# Altium schematic sheet 04_FEATHER-CONNECTION.SchDoc
size A4; CheckedBy: Inženjer 2; CompanyName: Byte Lab Grupa d.o.o.; Engineer: Matija Puskar; Organization: Byte Lab Grupa d.o.o.; Address1: Medarska 69/1, 10000 Zagreb, Croatia; DocumentNumber: 1; SheetNumber: 4; SheetTotal: 7; Web: www.byte-lab.com; ProjectName: P1X-0XX
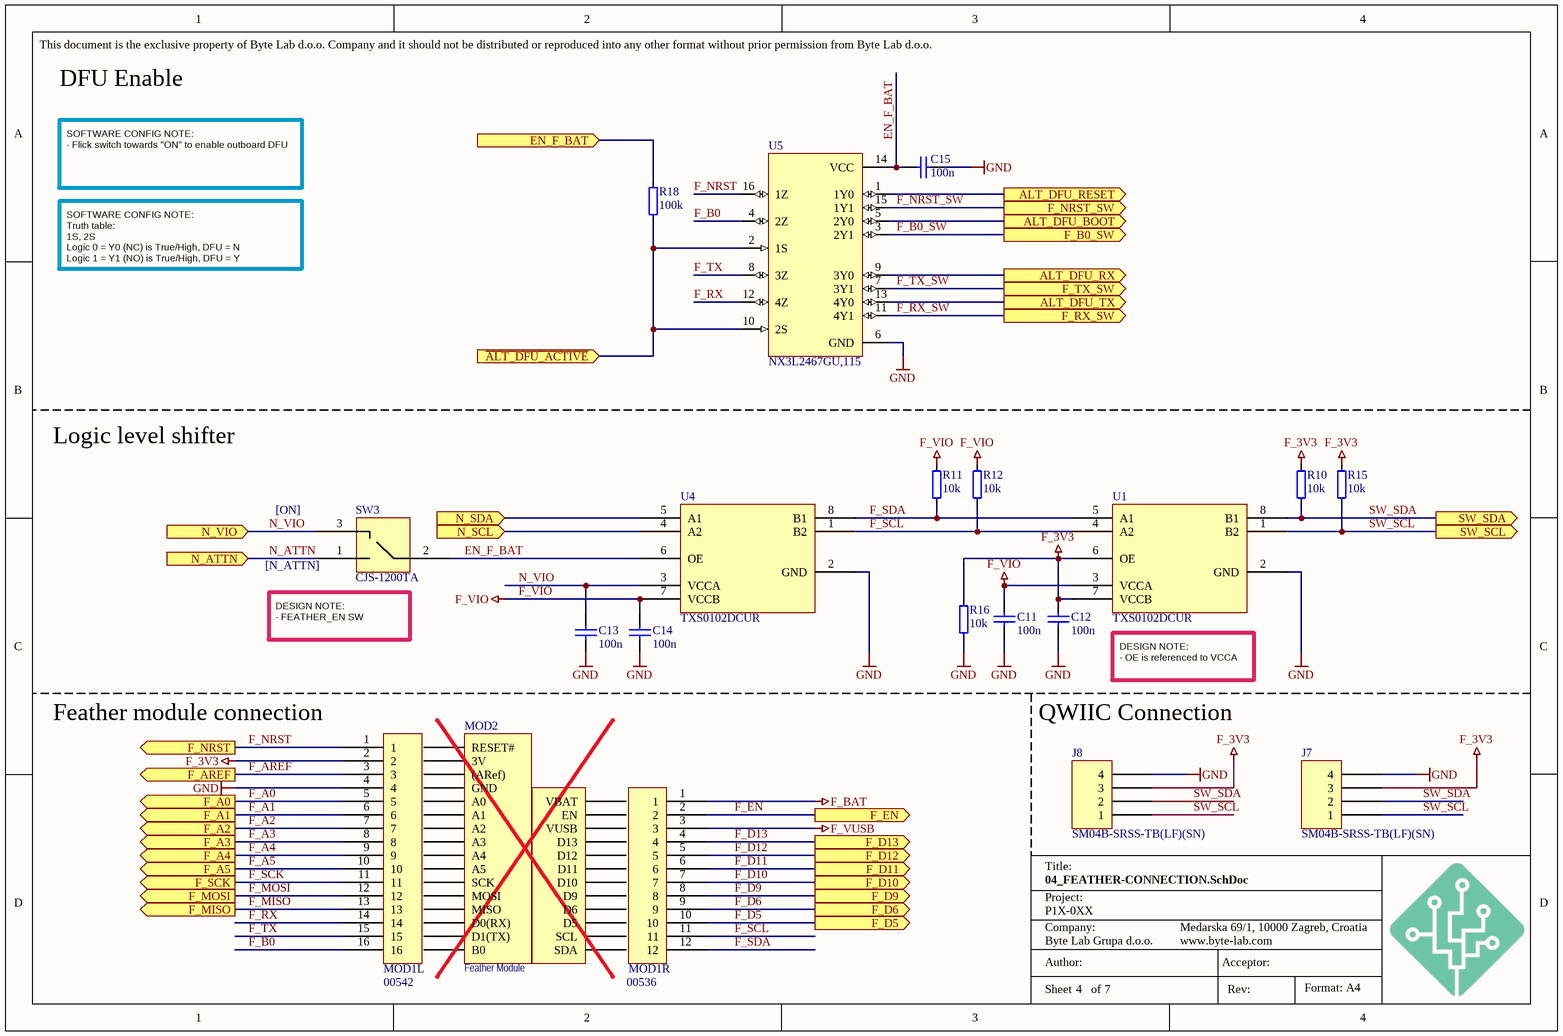
[diagram p0: 04_FEATHER-CONNECTION.SchDoc]

## Parts
C11  100n  [C-0402]
C12  100n  [C-0402]
C13  100n  [C-0402]
C14  100n  [C-0402]
C15  100n  [C-0402]
J7  SM04B-SRSS-TB(LF)(SN)  [JST SM04B-SRSS-TB]
J8  SM04B-SRSS-TB(LF)(SN)  [JST SM04B-SRSS-TB]
MOD1L  00542  [16PIN_254MM]
MOD1R  00536  [12PIN_254MM]
MOD2  Feather Module  [BLUES_WIRELESS_SWAN_2-54_HEADERS]  (no BOM)
R10  10k  [R-0402]
R11  10k  [R-0402]
R12  10k  [R-0402]
R15  10k  [R-0402]
R16  10k  [R-0402]
R18  100k  [R-0402]
SW3  CJS-1200TA  [SW_CJS-1200TA]
U1  TXS0102DCUR  [SOP50P310X90-8N]
U4  TXS0102DCUR  [SOP50P310X90-8N]
U5  NX3L2467GU,115  [QFN40P180X260X55-16N]

## Ports
ALT_DFU_BOOT (out), ALT_DFU_RESET (out), ALT_DFU_RX (out), ALT_DFU_TX (out), EN_F_BAT (in), F_A0 (out), F_A1 (out), F_A2 (out), F_A3 (out), F_A4 (out), F_A5 (out), F_AREF (out), F_B0_SW (out), F_D5 (out), F_D6 (out), F_D9 (out), F_D10 (out), F_D11 (out), F_D12 (out), F_D13 (out), F_EN (out), F_MISO (out), F_MOSI (out), F_NRST (out), F_NRST_SW (out), F_RX_SW (out), F_SCK (out), F_TX_SW (out), N_ATTN (in), N_SCL (in), N_SDA (in), N_VIO (in), SW_SCL (out), SW_SDA (out), ~{ALT_DFU_ACTIVE} (in)

## Nets
F_3V3: C12.1 J7.3 J8.3 MOD1L.2 R10.2 R15.2 R16.1 U1.6(OE) U1.7(VCCB)
F_BAT: MOD1R.1
F_VIO: C11.1 C14.1 R11.2 R12.2 U1.3(VCCA) U4.7(VCCB)
F_VUSB: MOD1R.3
GND: C11.2 C12.2 C13.2 C14.2 C15.1 J7.4 J8.4 MOD1L.4 R16.2 U1.2(GND) U4.2(GND) U5.6(GND)
~{ALT_DFU_ACTIVE}: R18.1 U5.2(1S) U5.10(2S) ; port ~{ALT_DFU_ACTIVE}
ALT_DFU_BOOT: U5.5(2Y0) ; port ALT_DFU_BOOT
ALT_DFU_RESET: U5.1(1Y0) ; port ALT_DFU_RESET
ALT_DFU_RX: U5.9(3Y0) ; port ALT_DFU_RX
ALT_DFU_TX: U5.13(4Y0) ; port ALT_DFU_TX
EN_F_BAT: C15.2 SW3.2 U4.6(OE) U5.14(VCC)
EN_F_BAT: R18.2 ; port EN_F_BAT  [a separate net that carries the same name]
F_A0: MOD1L.5 ; port F_A0
F_A1: MOD1L.6 ; port F_A1
F_A2: MOD1L.7 ; port F_A2
F_A3: MOD1L.8 ; port F_A3
F_A4: MOD1L.9 ; port F_A4
F_A5: MOD1L.10 ; port F_A5
F_AREF: MOD1L.3 ; port F_AREF
F_B0: MOD1L.16 U5.4(2Z)
F_B0_SW: U5.3(2Y1) ; port F_B0_SW
F_D5: MOD1R.10 ; port F_D5
F_D6: MOD1R.9 ; port F_D6
F_D9: MOD1R.8 ; port F_D9
F_D10: MOD1R.7 ; port F_D10
F_D11: MOD1R.6 ; port F_D11
F_D12: MOD1R.5 ; port F_D12
F_D13: MOD1R.4 ; port F_D13
F_EN: MOD1R.2 ; port F_EN
F_MISO: MOD1L.13 ; port F_MISO
F_MOSI: MOD1L.12 ; port F_MOSI
F_NRST: MOD1L.1 U5.16(1Z) ; port F_NRST
F_NRST_SW: U5.15(1Y1) ; port F_NRST_SW
F_RX: MOD1L.14 U5.12(4Z)
F_RX_SW: U5.11(4Y1) ; port F_RX_SW
F_SCK: MOD1L.11 ; port F_SCK
F_SCL: MOD1R.11 R12.1 U1.4(A2) U4.1(B2)
F_SDA: MOD1R.12 R11.1 U1.5(A1) U4.8(B1)
F_TX: MOD1L.15 U5.8(3Z)
F_TX_SW: U5.7(3Y1) ; port F_TX_SW
N_ATTN: SW3.1 ; port N_ATTN
N_SCL: U4.4(A2) ; port N_SCL
N_SDA: U4.5(A1) ; port N_SDA
N_VIO: C13.1 SW3.3 U4.3(VCCA) ; port N_VIO
SW_SCL: J7.1 J8.1 R15.1 U1.1(B2) ; port SW_SCL
SW_SDA: J7.2 J8.2 R10.1 U1.8(B1) ; port SW_SDA

Not connected (* = marked no-connect by the designer): MOD2 1(RESET#) 2(3V) 3((ARef)) 4(GND) 5(A0) 6(A1) 7(A2) 8(A3) 9(A4) 10(A5) 11(SCK) 12(MOSI) 13(MISO) 14(D0(RX)) 15(D1(TX)) 16(B0) 17(SDA) 18(SCL) 19(D5) 20(D6) 21(D9) 22(D10) 23(D11) 24(D12) 25(D13) 26(VUSB) 27(EN) 28(VBAT)

## Notes on the sheet
- DFU Enable
- SOFTWARE CONFIG NOTE:
  - Flick switch towards "ON" to enable outboard DFU
- SOFTWARE CONFIG NOTE:
  Truth table:
  1S, 2S
  Logic 0 = Y0 (NC) is True/High, DFU = N
  Logic 1 = Y1 (NO) is True/High, DFU = Y
- Logic level shifter
- [ON]
- (near SW3) [N_ATTN]
- (near SW3) DESIGN NOTE:
  - FEATHER_EN SW
- DESIGN NOTE:
  - OE is referenced to VCCA
- (near MOD1L) Feather module connection
- QWIIC Connection
- This document is the exclusive property of Byte Lab d.o.o. Company and it should not be distributed or reproduced into any other format without prior permission from Byte Lab d.o.o.
- Project:
- Title:
- Author:
- Company:
- Acceptor:
- Format: A4
- Sheet
- of
- Rev:

## Library data of the parts
C11-C15 = C0402-100n-16V-X7R: Capacitor ceramic 100n ±10% X7R 16V 0402; BL Part Number: 2000-908; Drawn_By: Puskar; Checked_By: Dodig; Manufacturer: N/A; Supplier 1: Digi-Key; Supplier Part Number 1: 490-3261-1-ND; Note: *; Manufacturer Part Number: N/A; DateModified: 27-08-2013
J7 J8 = SM04B-SRSS-TB(LF)(SN): CONN HEADER SH 4POS SIDE 1MM TIN; Manufacturer: JST Sales America Inc.; BL Part Number: 2002-058; Drawn_By: Blues Wireless; Supplier 1: Digi-Key; Manufacturer Part Number: SM04B-SRSS-TB(LF)(SN); Supplier Part Number 1: 455-1804-1-ND
MOD1L = SOCKET_LFB_16: Socket 16-Pin, 0.100 in; Manufacturer: 4UCON; BL Part Number: 2010-423; Drawn_By: Blues Wireless; Supplier 1: *; Supplier Part Number 1: *; Manufacturer Part Number: 00542
MOD1R = SOCKET_LFB_12: Socket 12-Pin, 0.100 in; Manufacturer: 4UCON; BL Part Number: 2010-424; Drawn_By: Blues Wireless; Supplier 1: *; Supplier Part Number 1: *; Manufacturer Part Number: 00536
MOD2 = ADAFRUIT_FEATHER_COMMON_1: Typical Adafruit Feather Pinout
R10-R12 R15 R16 = R0402-10k-1: Resistor 10k ±1% 0402; BL Part Number: 2000-729; Checked_By: Dodig; Drawn_By: Puskar; Supplier 1: Digi-Key; Manufacturer: N/A; Manufacturer Part Number: N/A; Supplier Part Number 1: 311-10.0KLRCT-ND; DateModified: 27-08-2013; Note: *
R18 = R0402-100k-1: Resistor 100k ±1% 0402; BL Part Number: 2000-727; Checked_By: Dodig; Drawn_By: Puskar; Supplier 1: Digi-Key; Manufacturer: N/A; Manufacturer Part Number: N/A; Supplier Part Number 1: RHM100CDCT-ND; DateModified: 27-10-2013; Note: *
SW3 = CJS-1200TA: Switch Slide N.O./N.C. SPDT Raised Slide 0.1A 24VDC J-Hook SMD Embossed T/R; Manufacturer: Nidec Copal; BL Part Number: 2007-456; Drawn_By: Blues Wireless; Supplier 1: Digi-Key; Manufacturer Part Number: CJS-1200TA; Supplier Part Number 1: 563-1021-6-ND
U1 U4 = TXS0102DCUR: 2-Bit Bidirectional Voltage-Level Shifter for Open-Drain and Push-Pull Application 8-VSSOP -40 to 85; Manufacturer: Texas Instruments; BL Part Number: 2007-455; Drawn_By: Blues Wireless; Supplier 1: Digi-Key; Manufacturer Part Number: TXS0102DCUR; Supplier Part Number 1: 296-21931-6-ND
U5 = NX3L2467GU,115: IC ANALOG SWITCH DPDTX2 16XQFN; Manufacturer: NXP; BL Part Number: 2009-148; Checked_By: Duracic; Drawn_By: Marsic; DateModified: 26-11-2025; Manufacturer Part Number: NX3L2467GU,115; Note: *